# EAGLE schematic malp (EAGLE 7.0.0)
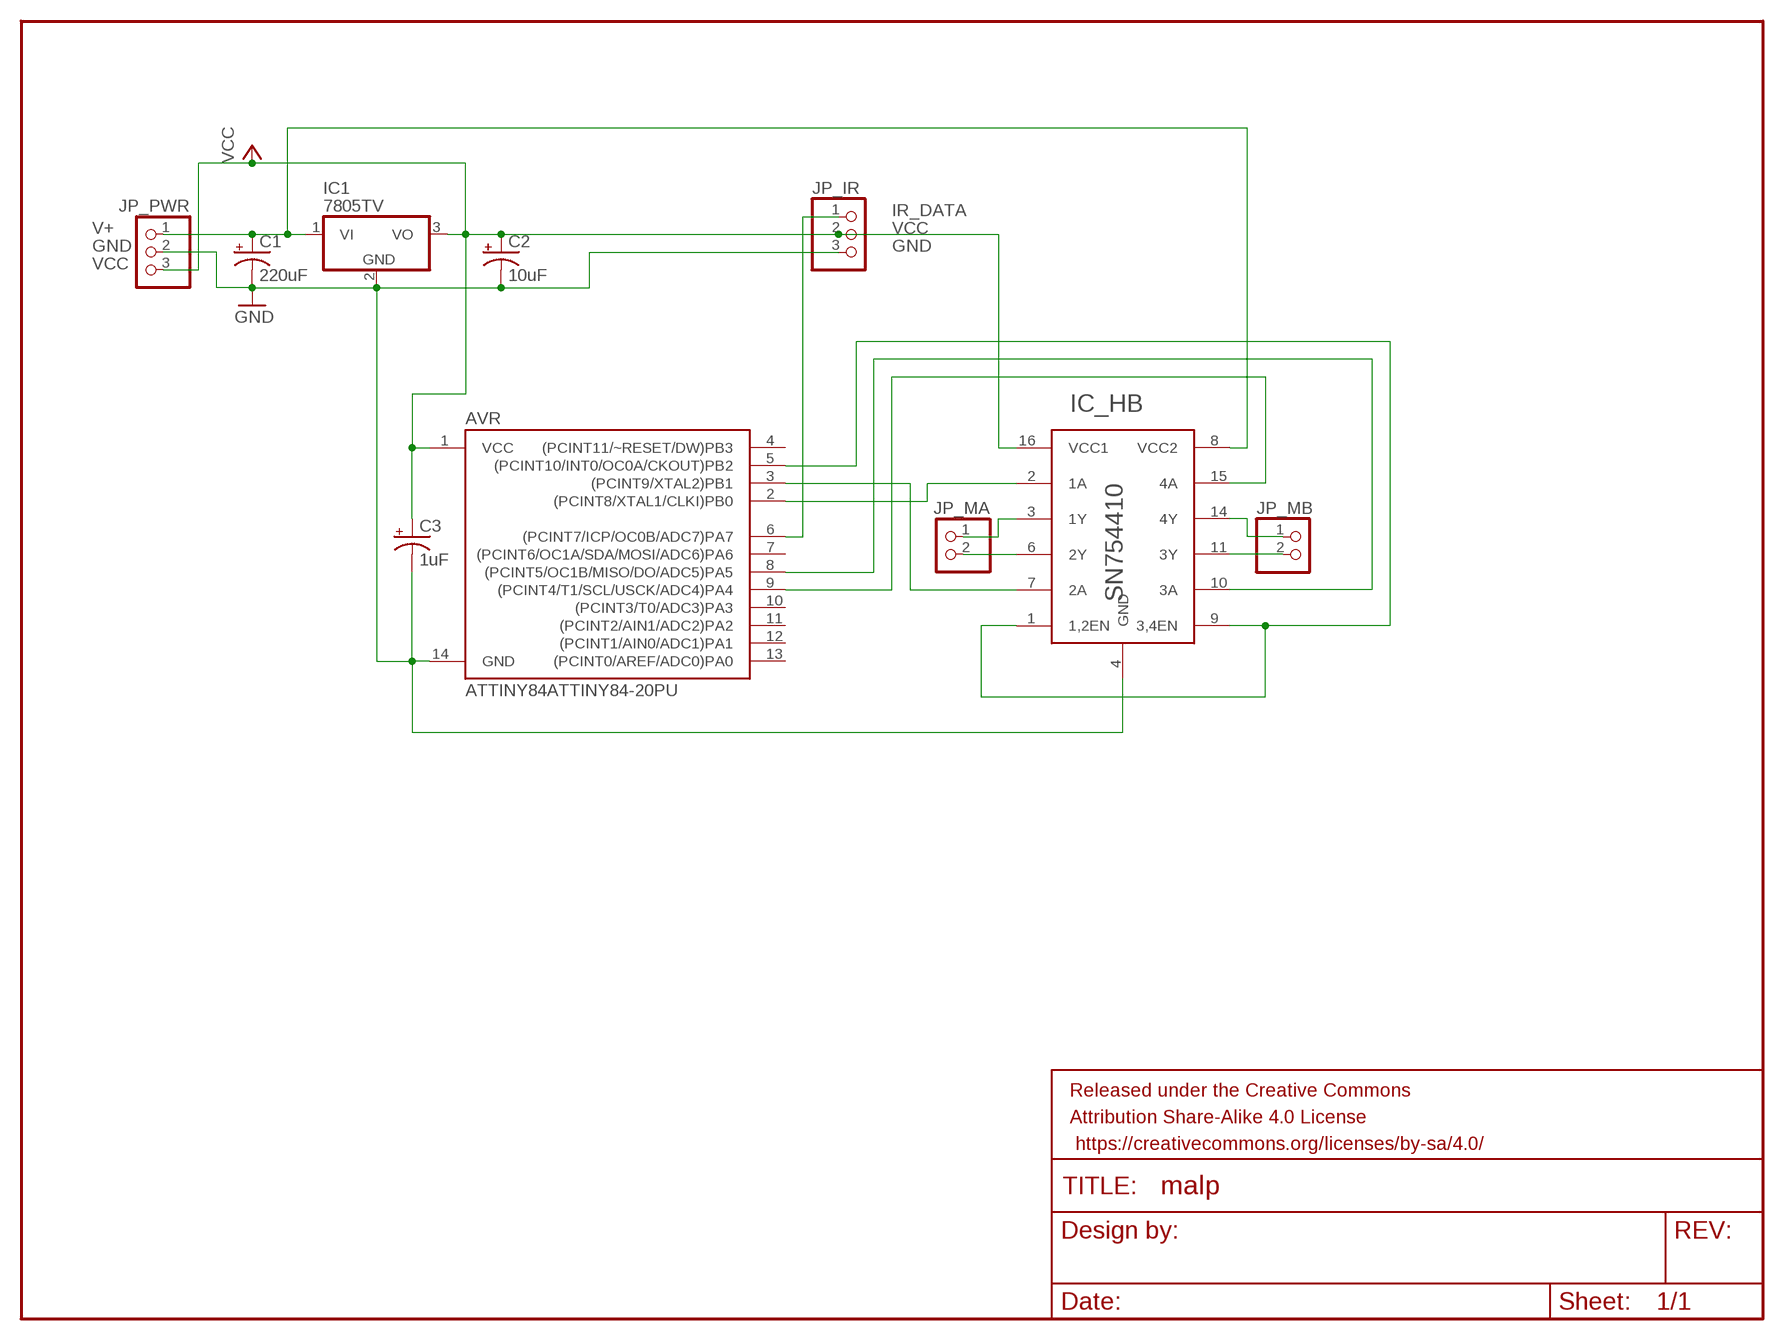
[diagram p0: schematic, sheet 1]

## Parts
AVR  ATTINY84ATTINY84-20PU  [DIL14]
C1  220uF  CPOL-USB45181A  [B45181A]
C2  10uF  CPOL-USB45181A  [B45181A]
C3  1uF  CPOL-USB45181A  [B45181A]
FRAME1  FRAME-LETTER  [CREATIVE_COMMONS]
IC1  7805TV  [TO220V]
IC_HB  SN754410  [DIL16]
JP_IR  PINHD-1X3  [1X03]
JP_MA  PINHD-1X2  [1X02]
JP_MB  PINHD-1X2  [1X02]
JP_PWR  PINHD-1X3  [1X03]

## Nets
GND: AVR.14(GND) C1.- C2.- C3.- IC1.2(GND) IC_HB.4(GND) JP_IR.3 JP_PWR.2
IR_DATA: AVR.6((PCINT7/ICP/OC0B/ADC7)PA7) JP_IR.1
N$1: AVR.5((PCINT10/INT0/OC0A/CKOUT)PB2) IC_HB.1(1,2EN) IC_HB.9(3,4EN)
N$2: AVR.2((PCINT8/XTAL1/CLKI)PB0) IC_HB.2(1A)
N$3: AVR.9((PCINT4/T1/SCL/USCK/ADC4)PA4) IC_HB.15(4A)
N$4: AVR.3((PCINT9/XTAL2)PB1) IC_HB.7(2A)
N$5: AVR.8((PCINT5/OC1B/MISO/DO/ADC5)PA5) IC_HB.10(3A)
N$6: IC_HB.14(4Y) JP_MB.1
N$7: IC_HB.11(3Y) JP_MB.2
N$8: IC_HB.6(2Y) JP_MA.2
N$9: IC_HB.3(1Y) JP_MA.1
V+: C1.+ IC1.1(VI) IC_HB.8(VCC2) JP_PWR.1
VCC: AVR.1(VCC) C2.+ C3.+ IC1.3(VO) IC_HB.16(VCC1) JP_IR.2 JP_PWR.3
Unconnected: AVR.4((PCINT11/~RESET/DW)PB3) AVR.7((PCINT6/OC1A/SDA/MOSI/ADC6)PA6) AVR.10((PCINT3/T0/ADC3)PA3) AVR.11((PCINT2/AIN1/ADC2)PA2) AVR.12((PCINT1/AIN0/ADC1)PA1) AVR.13((PCINT0/AREF/ADC0)PA0)

## Power pins joined to a net without a drawn wire
GND: IC_HB.5(GND) IC_HB.12(GND) IC_HB.13(GND)

## Library data of the parts
AVR = SparkFun-DigitalIC:ATTINY84: Atmel 14-pin 2/4/8kB flash uC
C1-C3 = rcl:CPOL-US: POLARIZED CAPACITOR, American symbol
FRAME1 = SparkFun-Aesthetics:FRAME-LETTER: Schematic Frame Standard 8.5x11 US Letter frame
IC1 = linear:78*: Positive VOLTAGE REGULATOR Source: http://cache.national.com/ds/LM/LM78L05.pdf http://www.fairchildsemi.com/ds/LM/LM7805.pdf
IC_HB = DualBridge:SN754410: Quad Half-Bridge Driver
JP_IR JP_PWR = pinhead:PINHD-1X3: PIN HEADER
JP_MA JP_MB = pinhead:PINHD-1X2: PIN HEADER